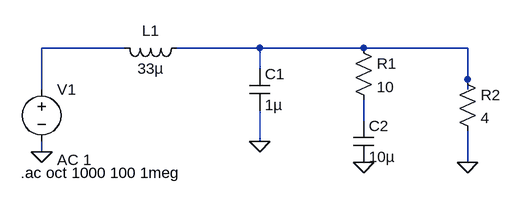
[diagram p0: schematic ClassD_Filter.asc]
ClassD_Filter.asc, the LTspice schematic file:
Version 4
SHEET 1 880 680
WIRE 80 96 -48 96
WIRE 288 96 160 96
WIRE 448 96 288 96
WIRE 608 96 448 96
WIRE 288 128 288 96
WIRE 608 144 608 96
WIRE -48 160 -48 96
WIRE 608 160 608 144
WIRE 448 208 448 176
WIRE 288 240 288 192
WIRE -48 256 -48 240
WIRE 608 272 608 224
FLAG 288 240 0
FLAG -48 256 0
FLAG 448 272 0
FLAG 608 272 0
SYMBOL ind 176 80 R90
WINDOW 0 5 56 VBottom 2
WINDOW 3 32 56 VTop 2
SYMATTR InstName L1
SYMATTR Value 33µ
SYMBOL cap 272 128 R0
SYMATTR InstName C1
SYMATTR Value 1µ
SYMBOL voltage -48 144 R0
WINDOW 123 24 124 Left 2
WINDOW 39 0 0 Left 0
SYMATTR Value2 AC 1
SYMATTR InstName V1
SYMATTR Value ""
SYMBOL res 432 80 R0
SYMATTR InstName R1
SYMATTR Value 10
SYMBOL cap 432 208 R0
SYMATTR InstName C2
SYMATTR Value 10µ
SYMBOL res 592 128 R0
SYMATTR InstName R2
SYMATTR Value 4
TEXT -80 288 Left 2 !.ac oct 1000 100 1meg

The netlist it stands for:
* ClassD_Filter.asc
L1 N002 N001 33µ
C1 N002 0 1µ
V1 N001 0 AC 1
R1 N002 N003 10
C2 N003 0 10µ
R2 N002 0 4
.ac oct 1000 100 1meg
.backanno
.end